# Altium schematic sheet LED-drive-Red.SchDoc
size A4; SheetNumber: 2; SheetTotal: 3
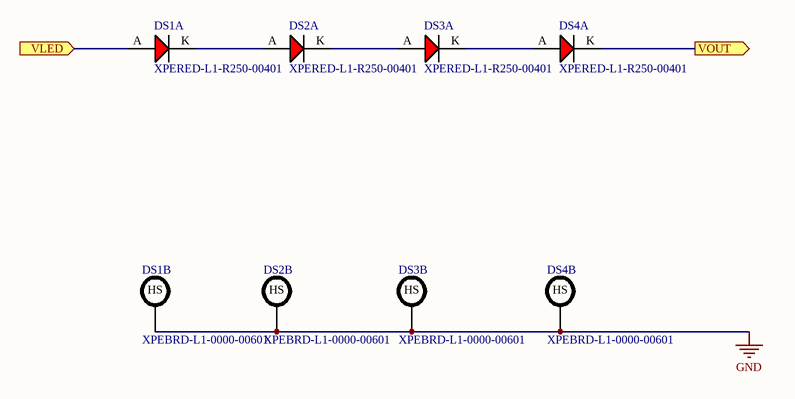
[diagram p0: LED-drive-Red.SchDoc]

## Parts
DS1  XPERED-L1-R250-00401  [Cree XLamp XP-E2 (red and green LED)]  (parts A,B of 2)
DS2  XPERED-L1-R250-00401  [Cree XLamp XP-E2 (red and green LED)]  (parts A,B of 2)
DS3  XPERED-L1-R250-00401  [Cree XLamp XP-E2 (red and green LED)]  (parts A,B of 2)
DS4  XPERED-L1-R250-00401  [Cree XLamp XP-E2 (red and green LED)]  (parts A,B of 2)

## Ports
VLED (in), VOUT (out)

## Nets
GND: DS1.HS DS2.HS DS3.HS DS4.HS
VLED: DS1.A ; port VLED
VOUT: DS4.K ; port VOUT
NetDS1_K: DS1.K DS2.A
NetDS2_K: DS2.K DS3.A
NetDS3_K: DS3.K DS4.A

## Library data of the parts
DS1-DS4 = XPEBRD-L1-0000-00601: LED, Cree XLamp XP-E2 Series, Red, 630 nm, 130 °, 62 lm, 1 A; ComponentLink1Description: Element14; ComponentLink1URL: https://au.element14.com/cree/xpebrd-l1-0000-00601/led-smd-xlamp-xpe-e-red-62lm/dp/2335107